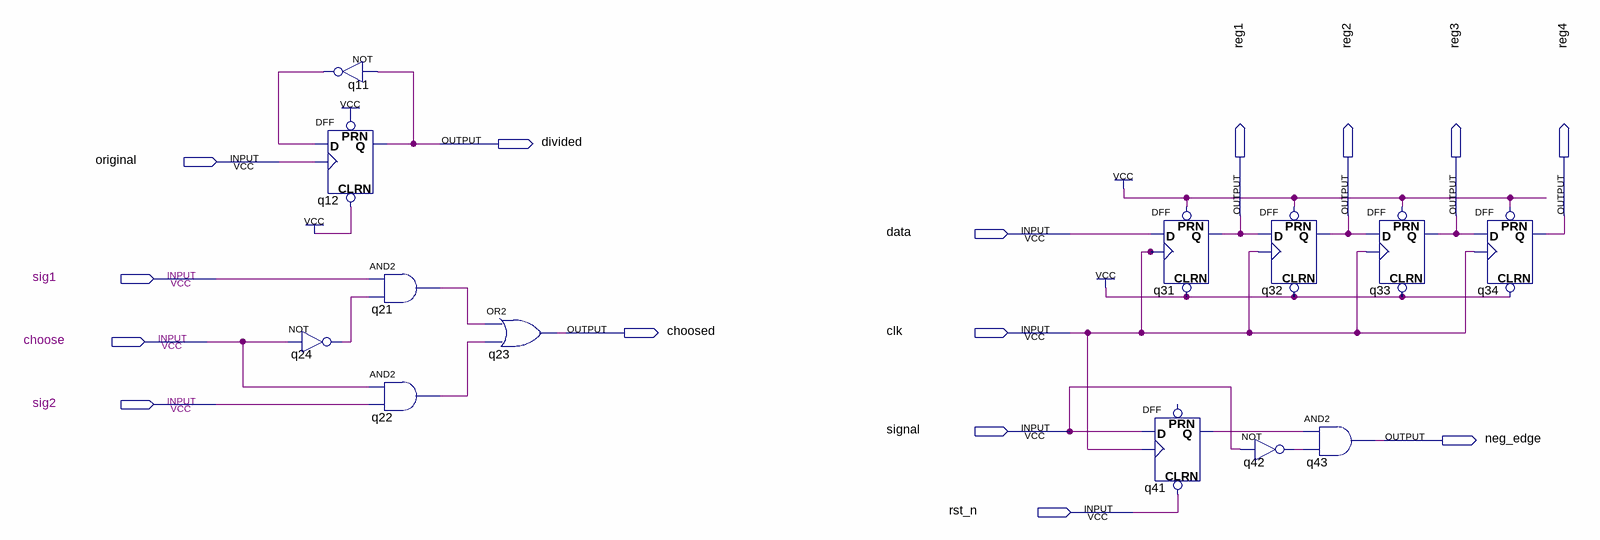
[diagram p0: schematic sheet]
// Quartus schematic week1.bdf as structural Verilog: 13 symbols, 15 pins
module week1 (
  input  original,
  input  data,
  input  sig1,
  input  clk,
  input  choose,
  input  sig2,
  input  signal,
  input  rst_n,
  output divided,
  output reg1,
  output reg2,
  output reg3,
  output reg4,
  output choosed,
  output neg_edge
);

  wire q11_out, q21_out, q22_out, q24_out, q41_q, q42_out;

  not q24 (q24_out, choose);
  not q11 (q11_out, divided);
  DFF q12 (.CLRN(1'b1), .CLK(original), .D(q11_out), .PRN(1'b1), .Q(divided));
  and q21 (q21_out, sig1, q24_out);
  and q22 (q22_out, choose, sig2);
  or q23 (choosed, q21_out, q22_out);
  DFF q31 (.CLRN(1'b1), .CLK(clk), .D(data), .PRN(1'b1), .Q(reg1));
  DFF q41 (.CLRN(rst_n), .CLK(clk), .D(signal), .Q(q41_q));  // open: PRN
  not q42 (q42_out, signal);
  DFF q32 (.CLRN(1'b1), .CLK(clk), .D(reg1), .PRN(1'b1), .Q(reg2));
  and q43 (neg_edge, q41_q, q42_out);
  DFF q33 (.CLRN(1'b1), .CLK(clk), .D(reg2), .PRN(1'b1), .Q(reg3));
  DFF q34 (.CLRN(1'b1), .CLK(clk), .D(reg3), .PRN(1'b1), .Q(reg4));
endmodule
